# Altium schematic sheet Tag201_Rev4.SchDoc
size B; CompanyName: Activewaveinc.com; DrawnBy: Touraj Ghaffari; Organization: Active wave Inc; Address1: 902 Clint Moore Rd.; Address2: Suite 126; Revision: 4.0; SheetNumber: 1; SheetTotal: 1; PageSetup: Record=PageOptions|CenterHorizontal=True|CenterVertical=True|PrintScale=1.09|XCorrection=1.00|YCorrection=1.00|PrintKind=2|BorderSize=5000000|LeftOffset=0|BottomOffset=0|Orientation=2|PaperLength=1000|PaperWidth=1000|Scale=100|PaperSource=7|PrintQuality=-4|MediaType=1|DitherType=10|PaperKind=11x17|PrintScaleMode=1
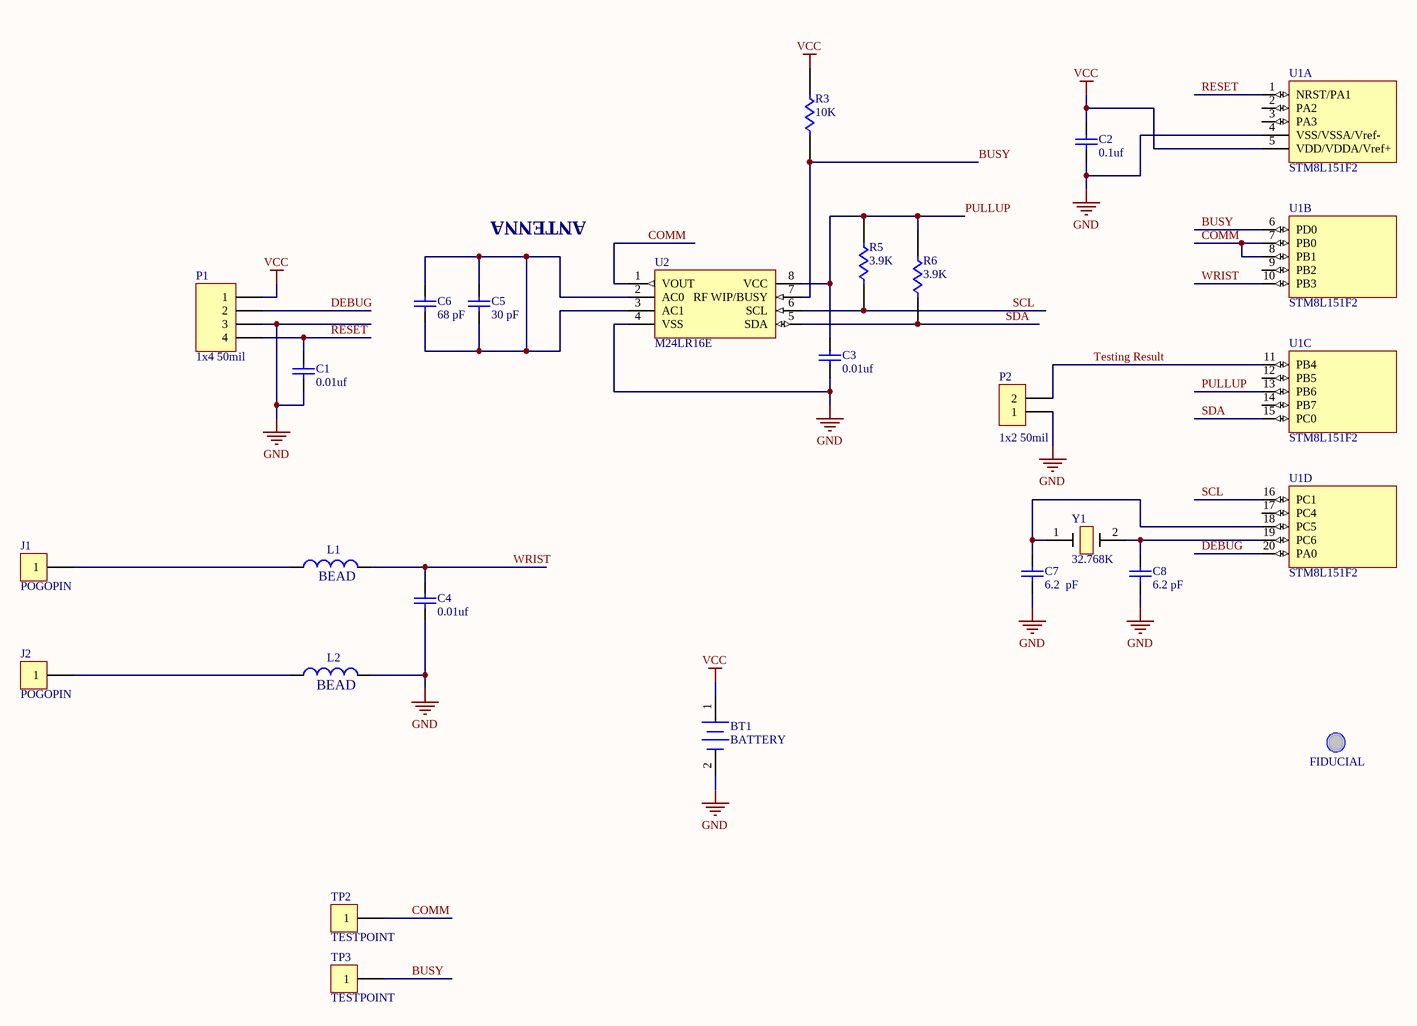
[diagram p0: Tag201_Rev4.SchDoc]

## Parts
BT1  BATTERY  [COINCELL2_040912]
C1  0.01uf  [0603_072205]
C2  0.1uf  [0603_072205]
C3  0.01uf  [0603_072205]
C4  0.01uf  [0603_072205]
C5  30 pF  [0603_072205]
C6  68 pF  [0603_072205]
C7  6.2  pF  [0603_072205]
C8  6.2 pF  [0603_072205]
FID1  FIDUCIAL  [FiducialTwoSide_020205]
J1  POGOPIN  [MilMax0910Pad_040912]
J2  POGOPIN  [MilMax0910Pad_040912]
L1  BEAD  [0603_072205]
L2  BEAD  [0603_072205]
P1  1x4 50mil  [1X4 HEADER_50mil_071411]
P2  (no value)  [1X2 HEADER_50mil_081611]
R3  10K  [0603_072205]
R5  3.9K  [0603_072205]
R6  3.9K  [0603_072205]
TP2  TESTPOINT  [TestPoint52x32]
TP3  TESTPOINT  [TestPoint52x32]
U1  STM8L151F2  [UFQFPN20ALT_041512]  (parts A,B,C,D of 4)
U2  M24LR16E  [TSSOP08_022410]
Y1  32.768K  [CRYSTAL32K_3.2mmx1.5mm_040912]

## Nets
GND: BT1.2(-) C1.2 C2.2 C3.2 C4.2 C7.2 C8.2 L2.1 P1.3 P2.1 U1.4(VSS/VSSA/Vref-) U2.4(VSS)
VCC: BT1.1(+) C2.1 P1.1 R3.1 U1.5(VDD/VDDA/Vref+)
BUSY: R3.2 TP3.1 U1.6(PD0) U2.7(RF_WIP/BUSY)
COMM: TP2.1 U1.7(PB0) U1.8(PB1) U2.1(VOUT)
DEBUG: P1.2 U1.20(PA0)
PULLUP: C3.1 R5.1 R6.1 U1.13(PB6) U2.8(VCC)
RESET: C1.1 P1.4 U1.1(NRST/PA1)
SCL: R5.2 U1.16(PC1) U2.6(SCL)
SDA: R6.2 U1.15(PC0) U2.5(SDA)
Testing Result: P2.2 U1.11(PB4)
WRIST: C4.1 L1.1 U1.10(PB3)
NetC5_1: C5.1 C5.2 C6.1 C6.2 U2.2(AC0) U2.3(AC1)
NetC7_1: C7.1 U1.18(PC5) Y1.1
NetC8_1: C8.1 U1.19(PC6) Y1.2
NetJ1_1: J1.1 L1.2
NetJ2_1: J2.1 L2.2

Not connected (* = marked no-connect by the designer): FID1 0; U1 2(PA2) 3(PA3) 9(PB2) 12(PB5) 14(PB7) 17(PC4)

## Notes on the sheet
- ANTENNA
- Title
- Size:
- Date:
- B
- Number:
- Time:
- Revision:
- Sheet
- of
- File:
- (in symbol CON2) 1x2 50mil

## Library data of the parts
BT1 = Battery: Multicell Battery; PARTNO: BLP2032SM-GTR; MFG: MPD; DK: BLP2032SM-GTR-ND; VALUE: BATTERY
C1 C3-C6 = Cap: Capacitor; PARTNO: C1608X7R1E103K; MAN: TDK; DK: 445-5100-1-ND
  C1 C3 C4: VALUE: 0.01uf
  C5: VALUE: 30 pF
  C6: VALUE: 68 pF
C2 = Cap: Capacitor; PARTNO: C1608X7R1C104K; MAN: TDK; VALUE: 0.1uf; DK: 445-1317-1-ND
C7 C8 = Cap: Capacitor; PARTNO: GRM1885C1H6R2DZ01D; MAN: Murata; DK: 490-1394-2-ND
  C7: VALUE: 6.2  pF
  C8: VALUE: 6.2 pF
FID1 = FiducialOneSide040: PARTNO: N/A; VALUE: FIDUCIAL
J1 J2 TP2 TP3 = CON1: Connector
  J1 J2: VALUE: POGOPIN
  TP2 TP3: VALUE: TESTPOINT
L1 L2 = CHOKE RF: COIL CHOKE 1UH SHIELDED SMD; MFG: Murata; MFG_PN: BLM18PG121SN1D; VALUE: BEAD; SUPPLIER: DigiKey; SUPPLIER_PN: 490-1037-1-ND
P1 = Header 4: Header, 4-Pin; VALUE: 1x4 50mil
P2 = CON2
R3 = RESISTOR: PARTNO: RC0603FR-07100KL; MAN: Yageo; VALUE: 10K; DK: 311-100KHRCT-ND
R5 R6 = RESISTOR: PARTNO: RC0603FR-0720KL; MAN: Yageo; VALUE: 3.9K; DK: 311-20.0KHRCT-ND
Y1 = CRYSTAL: VALUE: 32.768K
U1 = STM8L151F2: VALUE: STM8L151F2
U2 = M24LR16E: VALUE: M24LR16E